# EAGLE schematic LedMatrix-595 (EAGLE 8.0.1)
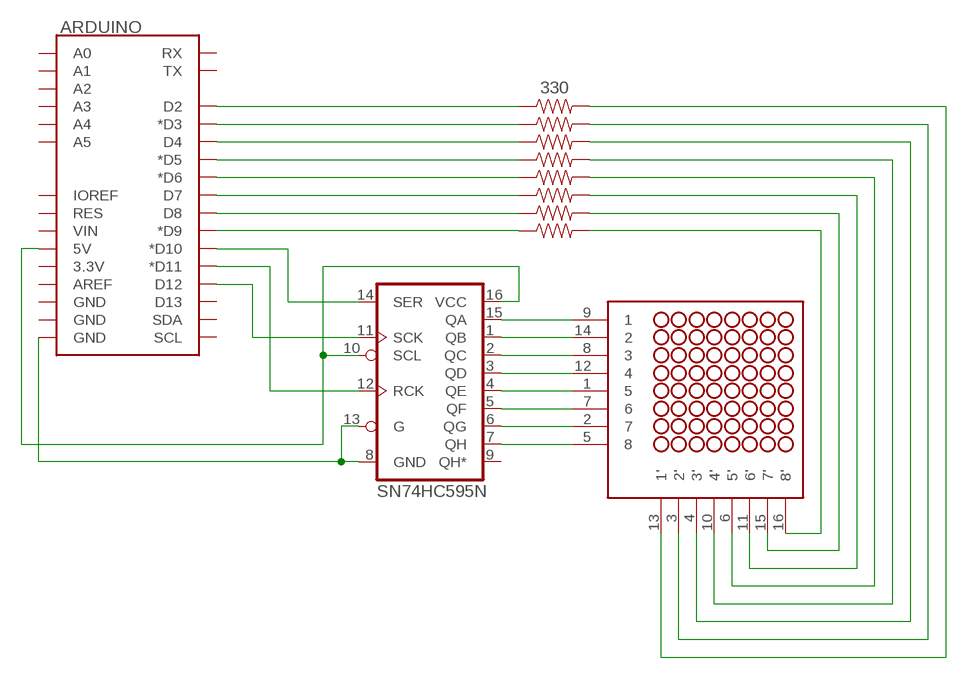
[diagram p0: schematic, sheet 1]

## Parts
ARDUINO  ARDUINO_UNO_R3_SHIELDBASIC  [UNO_R3_SHIELD]
R1  330  330OHM-HORIZ-1/10W-5%  [AXIAL-0.3]
R2  330  330OHM-HORIZ-1/10W-5%  [AXIAL-0.3]
R3  330  330OHM-HORIZ-1/10W-5%  [AXIAL-0.3]
R4  330  330OHM-HORIZ-1/10W-5%  [AXIAL-0.3]
R5  330  330OHM-HORIZ-1/10W-5%  [AXIAL-0.3]
R6  330  330OHM-HORIZ-1/10W-5%  [AXIAL-0.3]
R7  330  330OHM-HORIZ-1/10W-5%  [AXIAL-0.3]
R8  330  330OHM-HORIZ-1/10W-5%  [AXIAL-0.3]
U1  SN74HC595N  74HC595N  [DIP16]
U$1  NFM-12881BG-11  [NFM-12881BG-11]

## Nets
N$1: U1.15(QA) U$1.9
N$2: U1.1(QB) U$1.14
N$3: U1.2(QC) U$1.8
N$4: U1.3(QD) U$1.12
N$5: U1.4(QE) U$1.1
N$6: U1.5(QF) U$1.7
N$7: U1.6(QG) U$1.2
N$8: U1.7(QH) U$1.5
N$9: ARDUINO.D3(*D3) R2.P$1
N$10: ARDUINO.D4 R3.P$1
N$11: ARDUINO.D5(*D5) R4.P$1
N$12: ARDUINO.D6(*D6) R5.P$1
N$13: ARDUINO.D7 R6.P$1
N$14: R6.P$2 U$1.11(6')
N$15: R8.P$2 U$1.16(8')
N$16: R7.P$2 U$1.15(7')
N$17: ARDUINO.5V U1.10(SCL) U1.16(VCC)
N$18: ARDUINO.GND@0(GND) U1.8(GND) U1.13(G)
N$20: ARDUINO.D2 R1.P$1
N$21: R5.P$2 U$1.6(5')
N$22: R4.P$2 U$1.10(4')
N$23: R3.P$2 U$1.4(3')
N$24: R2.P$2 U$1.3(2')
N$25: R1.P$2 U$1.13(1')
N$26: ARDUINO.D8 R7.P$1
N$27: ARDUINO.D9(*D9) R8.P$1
N$28: ARDUINO.D10(*D10) U1.14(SER)
N$29: ARDUINO.D11(*D11) U1.12(RCK)
N$30: ARDUINO.D12 U1.11(SCK)
Unconnected: ARDUINO.3.3V ARDUINO.A0 ARDUINO.A1 ARDUINO.A2 ARDUINO.A3 ARDUINO.A4 ARDUINO.A5 ARDUINO.AREF ARDUINO.D13 ARDUINO.GND@1(GND) ARDUINO.GND@2(GND) ARDUINO.IOREF ARDUINO.RES ARDUINO.RX ARDUINO.SCL ARDUINO.SDA ARDUINO.TX ARDUINO.VIN U1.9(QH*)

## Library data of the parts
ARDUINO = SparkFun-Boards:ARDUINO_UNO_R3_SHIELD: Arduino R3 Shield Footprint Shield form compatible with the Arduino Uno R3. SparkFun Products: MG2639 Cellular Shield <https://www.sparkfun.com/products/13120> MIDI Shield <https://www.sparkfun.com/products/12898> R3 Stackable Headers Kit <https://www.sparkfun.com/products/11417>
R1-R8 = SparkFun-Resistors:330OHM: 330Ω resistor A resistor is a passive two-terminal electrical component that implements electrical resistance as a circuit element. Resistors act to reduce current flow, and, at the same time, act to lower voltage levels within circuits. - Wikipedia; PROD_ID: RES-8371
U1 = SparkFun-IC-Logic:74*595: 8-Bit Shift Register (Serial to Parallel) Datasheet <http://cdn.sparkfun.com/datasheets/BreakoutBoards/MM74HC595.pdf> SparkFun Products SparkFun Shift Register Breakout - 74HC595 <https://www.sparkfun.com/products/10680> (BOB-10680); PROD_ID: IC-13123
U$1 = eagle-library-edeca.net-v5:NFM-12881BG-11: Futurlec 8x8 LED Matrix